# Altium schematic sheet Connectors_1.SchDoc
size A4; DrawnBy: Emile Renaud; Revision: V2.0; SheetNumber: 7; SheetTotal: 8
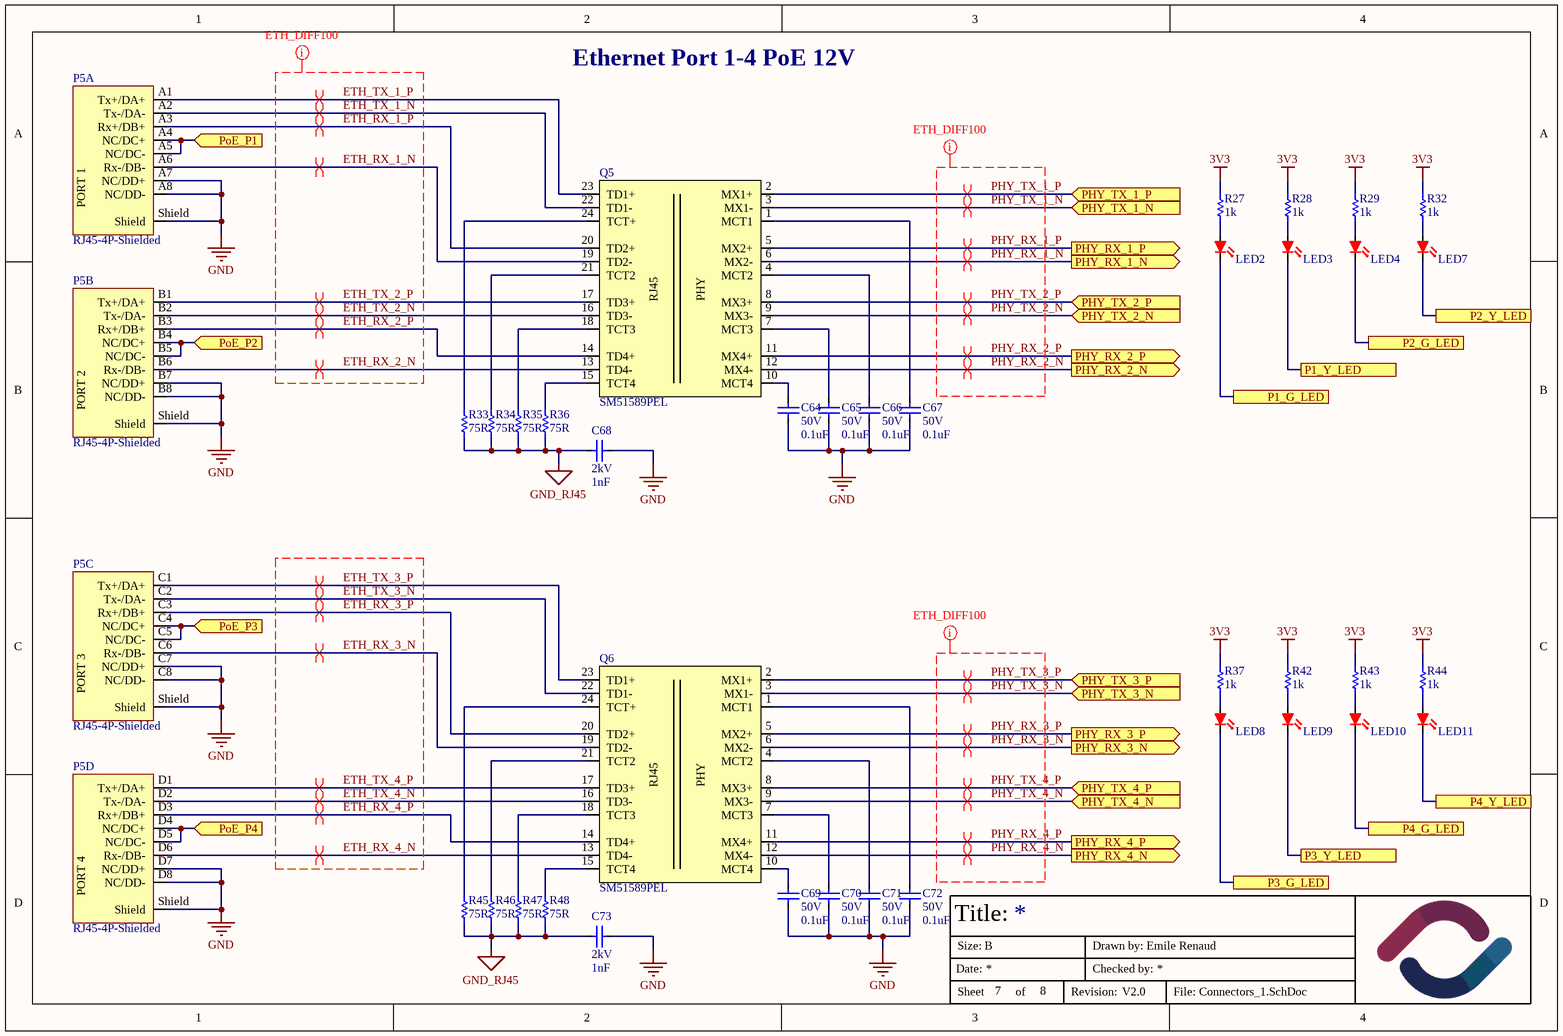
[diagram p0: Connectors_1.SchDoc]

## Parts
C64  value 0.1uF  Volt: 50V  [CAPACITOR-0603]  (hidden comment: Capacitor-0603-0.1uF-50V-X7R)
C65  value 0.1uF  Volt: 50V  [CAPACITOR-0603]  (hidden comment: Capacitor-0603-0.1uF-50V-X7R)
C66  value 0.1uF  Volt: 50V  [CAPACITOR-0603]  (hidden comment: Capacitor-0603-0.1uF-50V-X7R)
C67  value 0.1uF  Volt: 50V  [CAPACITOR-0603]  (hidden comment: Capacitor-0603-0.1uF-50V-X7R)
C68  value 1nF  Volt: 2kV  [CAPACITOR-1206]  (hidden comment: Capacitor-1206-1nF-2kV-X7R)
C69  value 0.1uF  Volt: 50V  [CAPACITOR-0603]  (hidden comment: Capacitor-0603-0.1uF-50V-X7R)
C70  value 0.1uF  Volt: 50V  [CAPACITOR-0603]  (hidden comment: Capacitor-0603-0.1uF-50V-X7R)
C71  value 0.1uF  Volt: 50V  [CAPACITOR-0603]  (hidden comment: Capacitor-0603-0.1uF-50V-X7R)
C72  value 0.1uF  Volt: 50V  [CAPACITOR-0603]  (hidden comment: Capacitor-0603-0.1uF-50V-X7R)
C73  value 1nF  Volt: 2kV  [CAPACITOR-1206]  (hidden comment: Capacitor-1206-1nF-2kV-X7R)
LED2  B1911USD-20D000114U1930  [LED-0603-2PIN]  (value not drawn)
LED3  B1911USD-20D000114U1930  [LED-0603-2PIN]  (value not drawn)
LED4  B1911USD-20D000114U1930  [LED-0603-2PIN]  (value not drawn)
LED7  B1911USD-20D000114U1930  [LED-0603-2PIN]  (value not drawn)
LED8  B1911USD-20D000114U1930  [LED-0603-2PIN]  (value not drawn)
LED9  B1911USD-20D000114U1930  [LED-0603-2PIN]  (value not drawn)
LED10  B1911USD-20D000114U1930  [LED-0603-2PIN]  (value not drawn)
LED11  B1911USD-20D000114U1930  [LED-0603-2PIN]  (value not drawn)
P5  RJ45-4P-Shielded  [ETH_A00-432-262-450]  (parts A,B,C,D of 4)
Q5  SM51589PEL  [SOIC24_BRN-M]
Q6  SM51589PEL  [SOIC24_BRN-M]
R27  value 1k  [Resistor-0603]  (hidden comment: SMT resistor)
R28  value 1k  [Resistor-0603]  (hidden comment: SMT resistor)
R29  value 1k  [Resistor-0603]  (hidden comment: SMT resistor)
R32  value 1k  [Resistor-0603]  (hidden comment: SMT resistor)
R33  value 75R  [Resistor-0603]  (hidden comment: SMT resistor)
R34  value 75R  [Resistor-0603]  (hidden comment: SMT resistor)
R35  value 75R  [Resistor-0603]  (hidden comment: SMT resistor)
R36  value 75R  [Resistor-0603]  (hidden comment: SMT resistor)
R37  value 1k  [Resistor-0603]  (hidden comment: SMT resistor)
R42  value 1k  [Resistor-0603]  (hidden comment: SMT resistor)
R43  value 1k  [Resistor-0603]  (hidden comment: SMT resistor)
R44  value 1k  [Resistor-0603]  (hidden comment: SMT resistor)
R45  value 75R  [Resistor-0603]  (hidden comment: SMT resistor)
R46  value 75R  [Resistor-0603]  (hidden comment: SMT resistor)
R47  value 75R  [Resistor-0603]  (hidden comment: SMT resistor)
R48  value 75R  [Resistor-0603]  (hidden comment: SMT resistor)

## Ports
P1_G_LED, P1_Y_LED, P2_G_LED, P2_Y_LED, P3_G_LED, P3_Y_LED, P4_G_LED, P4_Y_LED, PHY_RX_1_N (out), PHY_RX_1_P (out), PHY_RX_2_N (out), PHY_RX_2_P (out), PHY_RX_3_N (out), PHY_RX_3_P (out), PHY_RX_4_N (out), PHY_RX_4_P (out), PHY_TX_1_N (in), PHY_TX_1_P (in), PHY_TX_2_N (in), PHY_TX_2_P (in), PHY_TX_3_N (in), PHY_TX_3_P (in), PHY_TX_4_N (in), PHY_TX_4_P (in), PoE_P1 (in), PoE_P2 (in), PoE_P3 (in), PoE_P4 (in)

## Nets
3V3: R27.2 R28.2 R29.2 R32.2 R37.2 R42.2 R43.2 R44.2
GND: C64.1 C65.1 C66.1 C67.1 C68.2 C69.1 C70.1 C71.1 C72.1 C73.2 P5.A7(NC/DD+) P5.A8(NC/DD-) P5.B7(NC/DD+) P5.B8(NC/DD-) P5.C7(NC/DD+) P5.C8(NC/DD-) P5.D7(NC/DD+) P5.D8(NC/DD-) P5.Shield
GND_RJ45: C68.1 C73.1 R33.1 R34.1 R35.1 R36.1 R45.1 R46.1 R47.1 R48.1
ETH_RX_1_N: P5.A6(Rx-/DB-) Q5.19(TD2-)
ETH_RX_1_P: P5.A3(Rx+/DB+) Q5.20(TD2+)
ETH_RX_2_N: P5.B6(Rx-/DB-) Q5.13(TD4-)
ETH_RX_2_P: P5.B3(Rx+/DB+) Q5.14(TD4+)
ETH_RX_3_N: P5.C6(Rx-/DB-) Q6.19(TD2-)
ETH_RX_3_P: P5.C3(Rx+/DB+) Q6.20(TD2+)
ETH_RX_4_N: P5.D6(Rx-/DB-) Q6.13(TD4-)
ETH_RX_4_P: P5.D3(Rx+/DB+) Q6.14(TD4+)
ETH_TX_1_N: P5.A2(Tx-/DA-) Q5.22(TD1-)
ETH_TX_1_P: P5.A1(Tx+/DA+) Q5.23(TD1+)
ETH_TX_2_N: P5.B2(Tx-/DA-) Q5.16(TD3-)
ETH_TX_2_P: P5.B1(Tx+/DA+) Q5.17(TD3+)
ETH_TX_3_N: P5.C2(Tx-/DA-) Q6.22(TD1-)
ETH_TX_3_P: P5.C1(Tx+/DA+) Q6.23(TD1+)
ETH_TX_4_N: P5.D2(Tx-/DA-) Q6.16(TD3-)
ETH_TX_4_P: P5.D1(Tx+/DA+) Q6.17(TD3+)
P1_G_LED: LED2.1(K) ; port P1_G_LED
P1_Y_LED: LED3.1(K) ; port P1_Y_LED
P2_G_LED: LED4.1(K) ; port P2_G_LED
P2_Y_LED: LED7.1(K) ; port P2_Y_LED
P3_G_LED: LED8.1(K) ; port P3_G_LED
P3_Y_LED: LED9.1(K) ; port P3_Y_LED
P4_G_LED: LED10.1(K) ; port P4_G_LED
P4_Y_LED: LED11.1(K) ; port P4_Y_LED
PHY_RX_1_N: Q5.6(MX2-) ; port PHY_RX_1_N
PHY_RX_1_P: Q5.5(MX2+) ; port PHY_RX_1_P
PHY_RX_2_N: Q5.12(MX4-) ; port PHY_RX_2_N
PHY_RX_2_P: Q5.11(MX4+) ; port PHY_RX_2_P
PHY_RX_3_N: Q6.6(MX2-) ; port PHY_RX_3_N
PHY_RX_3_P: Q6.5(MX2+) ; port PHY_RX_3_P
PHY_RX_4_N: Q6.12(MX4-) ; port PHY_RX_4_N
PHY_RX_4_P: Q6.11(MX4+) ; port PHY_RX_4_P
PHY_TX_1_N: Q5.3(MX1-) ; port PHY_TX_1_N
PHY_TX_1_P: Q5.2(MX1+) ; port PHY_TX_1_P
PHY_TX_2_N: Q5.9(MX3-) ; port PHY_TX_2_N
PHY_TX_2_P: Q5.8(MX3+) ; port PHY_TX_2_P
PHY_TX_3_N: Q6.3(MX1-) ; port PHY_TX_3_N
PHY_TX_3_P: Q6.2(MX1+) ; port PHY_TX_3_P
PHY_TX_4_N: Q6.9(MX3-) ; port PHY_TX_4_N
PHY_TX_4_P: Q6.8(MX3+) ; port PHY_TX_4_P
PoE_P1: P5.A4(NC/DC+) P5.A5(NC/DC-) ; port PoE_P1
PoE_P2: P5.B4(NC/DC+) P5.B5(NC/DC-) ; port PoE_P2
PoE_P3: P5.C4(NC/DC+) P5.C5(NC/DC-) ; port PoE_P3
PoE_P4: P5.D4(NC/DC+) P5.D5(NC/DC-) ; port PoE_P4
NetC64_2: C64.2 Q5.10(MCT4)
NetC65_2: C65.2 Q5.7(MCT3)
NetC66_2: C66.2 Q5.4(MCT2)
NetC67_2: C67.2 Q5.1(MCT1)
NetC69_2: C69.2 Q6.10(MCT4)
NetC70_2: C70.2 Q6.7(MCT3)
NetC71_2: C71.2 Q6.4(MCT2)
NetC72_2: C72.2 Q6.1(MCT1)
NetLED2_2: LED2.2(R) R27.1
NetLED3_2: LED3.2(R) R28.1
NetLED4_2: LED4.2(R) R29.1
NetLED7_2: LED7.2(R) R32.1
NetLED8_2: LED8.2(R) R37.1
NetLED9_2: LED9.2(R) R42.1
NetLED10_2: LED10.2(R) R43.1
NetLED11_2: LED11.2(R) R44.1
NetQ5_15: Q5.15(TCT4) R36.2
NetQ5_18: Q5.18(TCT3) R35.2
NetQ5_21: Q5.21(TCT2) R34.2
NetQ5_24: Q5.24(TCT+) R33.2
NetQ6_15: Q6.15(TCT4) R48.2
NetQ6_18: Q6.18(TCT3) R47.2
NetQ6_21: Q6.21(TCT2) R46.2
NetQ6_24: Q6.24(TCT+) R45.2

## Layout directives
net class MDI_DIFF100: ETH_RX_1_N, ETH_RX_1_P, ETH_RX_2_N, ETH_RX_2_P, ETH_TX_1_N, ETH_TX_1_P, ETH_TX_2_N, ETH_TX_2_P, PHY_RX_1_N, PHY_RX_1_P, PHY_RX_2_N, PHY_RX_2_P, PHY_RX_3_N, PHY_RX_3_P, PHY_RX_4_N, PHY_RX_4_P, PHY_TX_1_N, PHY_TX_1_P, PHY_TX_2_N, PHY_TX_2_P, PHY_TX_3_N, PHY_TX_3_P, PHY_TX_4_N, PHY_TX_4_P
differential pair: ETH_RX_1_N, ETH_RX_1_P, ETH_RX_2_N, ETH_RX_2_P, ETH_RX_3_N, ETH_RX_3_P, ETH_RX_4_N, ETH_RX_4_P, ETH_TX_1_N, ETH_TX_1_P, ETH_TX_2_N, ETH_TX_2_P, ETH_TX_3_N, ETH_TX_3_P, ETH_TX_4_N, ETH_TX_4_P, PHY_RX_1_N, PHY_RX_1_P, PHY_RX_2_N, PHY_RX_2_P, PHY_RX_3_N, PHY_RX_3_P, PHY_RX_4_N, PHY_RX_4_P, PHY_TX_1_N, PHY_TX_1_P, PHY_TX_2_N, PHY_TX_2_P, PHY_TX_3_N, PHY_TX_3_P, PHY_TX_4_N, PHY_TX_4_P

## Notes on the sheet
- Ethernet Port 1-4 PoE 12V
- Title:
- Date:
- Size:
- B
- Drawn by:
- Checked by:
- Sheet
- of
- Revision:
- File:
- (in symbol RJ45-4Ports, part A) PORT 1
- (in symbol RJ45-4Ports, part B) PORT 2
- (in symbol RJ45-4Ports, part C) PORT 3
- (in symbol RJ45-4Ports, part D) PORT 4
- (in symbol SM51589PEL) RJ45; PHY

## Library data of the parts
C64-C67 C69-C72 = Capacitor-0603-0.1uF-50V-X7R: Precision: X7R-10%; Package / Case: Metric 1608, EIA 0603; Mounted: Yes; Supplier 1: Digi-Key; Supplier Part Number 1: 1276-1935-2-ND; Supplier 2: Digi-Key; Supplier Part Number 2: 1276-1934-2-ND
C68 C73 = Capacitor-1206-1nF-2kV-X7R: Precision: X7R-10%; Package / Case: Metric 3216, EIA 1206; Mounted: Yes; Supplier 1: Digi-Key; Supplier Part Number 1: 399-C1206C102KGRAC7800CT-ND; Supplier 2: Digi-Key
LED2-LED4 LED7-LED11 = B1911USD-20D000114U1930: LED RED CLEAR 0603 SMD; Package / Case: 0603 (1608 Metric); Mounted: Yes; Supplier 1: Digi-Key; Supplier Part Number 1: 3147-B1911USD-20D000114U1930CT-ND
P5 = RJ45-4Ports: Jack Modular Connector 8p8c (RJ45, Ethernet) 90° Angle (Right) Shielded Cat5; Supplier 1: Digikey; Supplier Part Number 1: 151-1120-ND; Mounted: Yes; Package / Case: TH; Volt: N/A; HelpURL: https://mm.digikey.com/Volume0/opasdata/d220001/medias/docus/971/A00-432-262-450.pdf
Q5 Q6 = SM51589PEL: 350µH LAN 10/100/1000 Base-T Pulse Transformer 1CT:1CT Surface Mount; Supplier 1: Digi-Key; Supplier Part Number 1: SM51589PELCT-ND; Package / Case: SOIC24; Mounted: Yes
R27-R29 R32 R37 R42-R44 = Resistor-0603-1k: Resistor0603-1k; Precision: 1%; Watt: 0.1W; Mounted: Yes; Package / Case: Metric 1608, EIA 0603; Supplier 1: Digi-Key; Supplier Part Number 1: 311-1.00KHRCT-ND
R33-R36 R45-R48 = Resistor-0603-75R: Resistor0603-75R; Precision: 1%; Watt: 0.1W; Mounted: Yes; Package / Case: Metric 1608, EIA 0603; Supplier 1: Digi-Key; Supplier Part Number 1: 311-75.0HRCT-ND